# EAGLE design MacroKeypadProMicro (EAGLE 9.6.2)
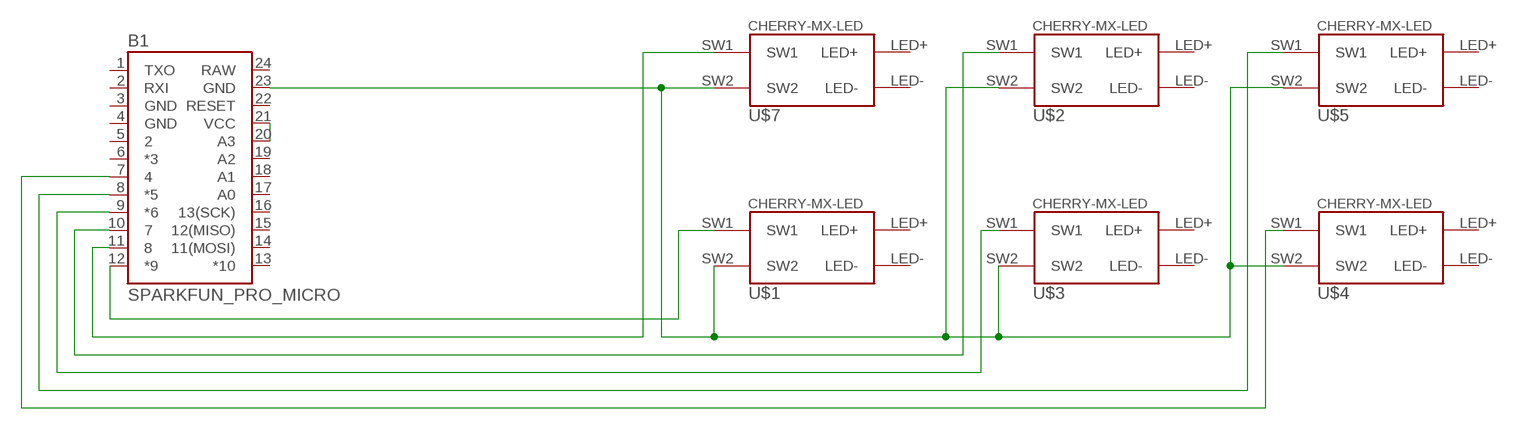
[diagram p0: schematic, sheet 1]

## Parts
B1  SPARKFUN_PRO_MICRO  [SPARKFUN_PRO_MICRO]
U$1  CHERRY-MX-LED  [CHERRY-MX-LED]
U$2  CHERRY-MX-LED  [CHERRY-MX-LED]
U$3  CHERRY-MX-LED  [CHERRY-MX-LED]
U$4  CHERRY-MX-LED  [CHERRY-MX-LED]
U$5  CHERRY-MX-LED  [CHERRY-MX-LED]
U$7  CHERRY-MX-LED  [CHERRY-MX-LED]

## Nets
GND: B1.23(GND) U$1.SW2 U$2.SW2 U$3.SW2 U$4.SW2 U$5.SW2 U$7.SW2
N$2: B1.20(A3) B1.21(VCC)
SW1: B1.11 U$7.SW1
SW2: B1.9(*6) U$3.SW1
SW3: B1.7 U$4.SW1
SW4: B1.12(*9) U$1.SW1
SW5: B1.10 U$2.SW1
SW6: B1.8(*5) U$5.SW1
Unconnected: B1.1(TXO) B1.2(RXI) B1.5 B1.6(*3) B1.13(*10) B1.14(11(MOSI)) B1.15(12(MISO)) B1.16(13(SCK)) B1.17(A0) B1.18(A1) B1.19(A2) B1.22(RESET) U$1.LED+ U$1.LED- U$2.LED+ U$2.LED- U$3.LED+ U$3.LED- U$4.LED+ U$4.LED- U$5.LED+ U$5.LED- U$7.LED+ U$7.LED-

## Power pins joined to a net without a drawn wire
GND: B1.3(GND) B1.4(GND)
RAW: B1.24(RAW)

## Library data of the parts
B1 = SparkFun-Boards:SPARKFUN_PRO_MICRO: SparkFun Pro Micro Atmega32U4 compatible footprint. SparkFun Products: 3.3V/8MHz <https://www.sparkfun.com/products/12587> 5V/16MHz <https://www.sparkfun.com/products/12640>
U$1-U$5 U$7 = cherrymx:CHERRY-MX-LED: Cherry MX series keyswitch with LED

## Board
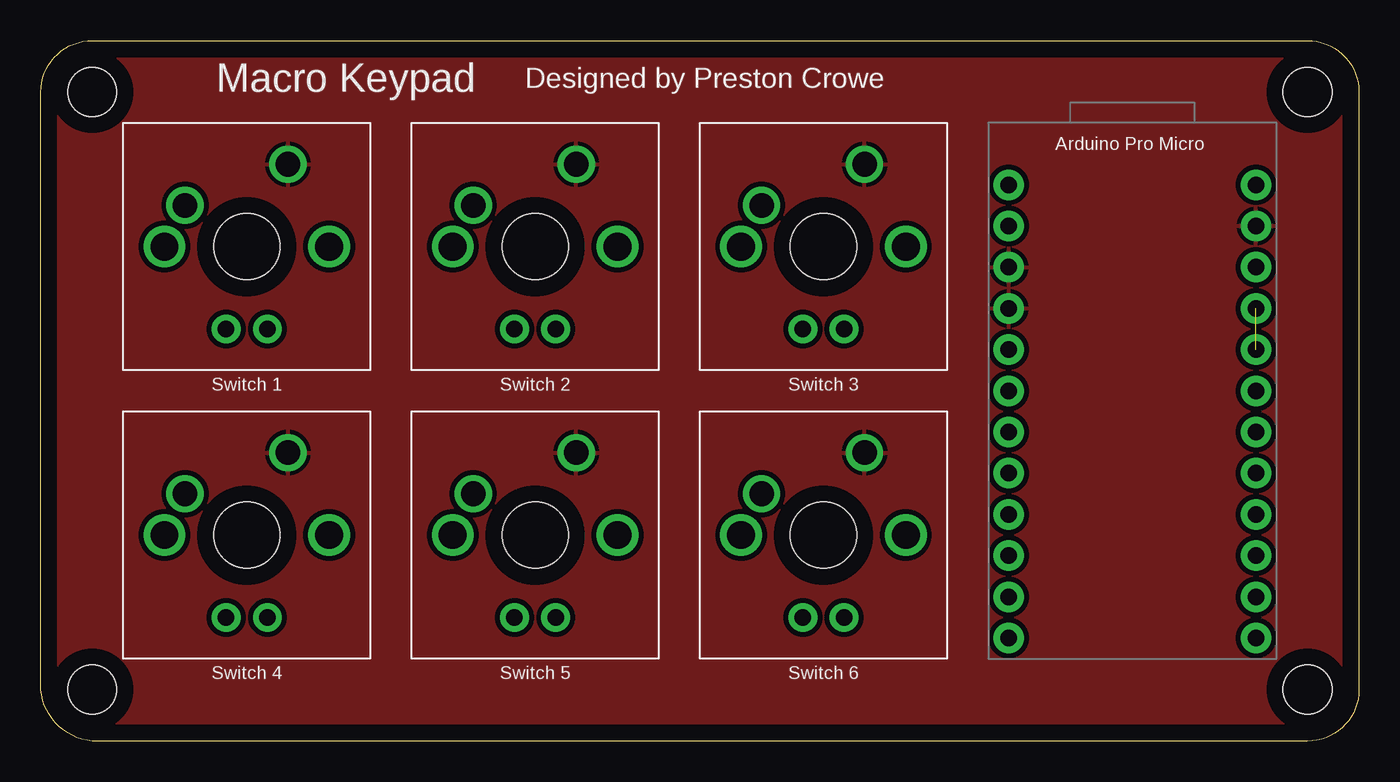
[diagram p1: board, top side]
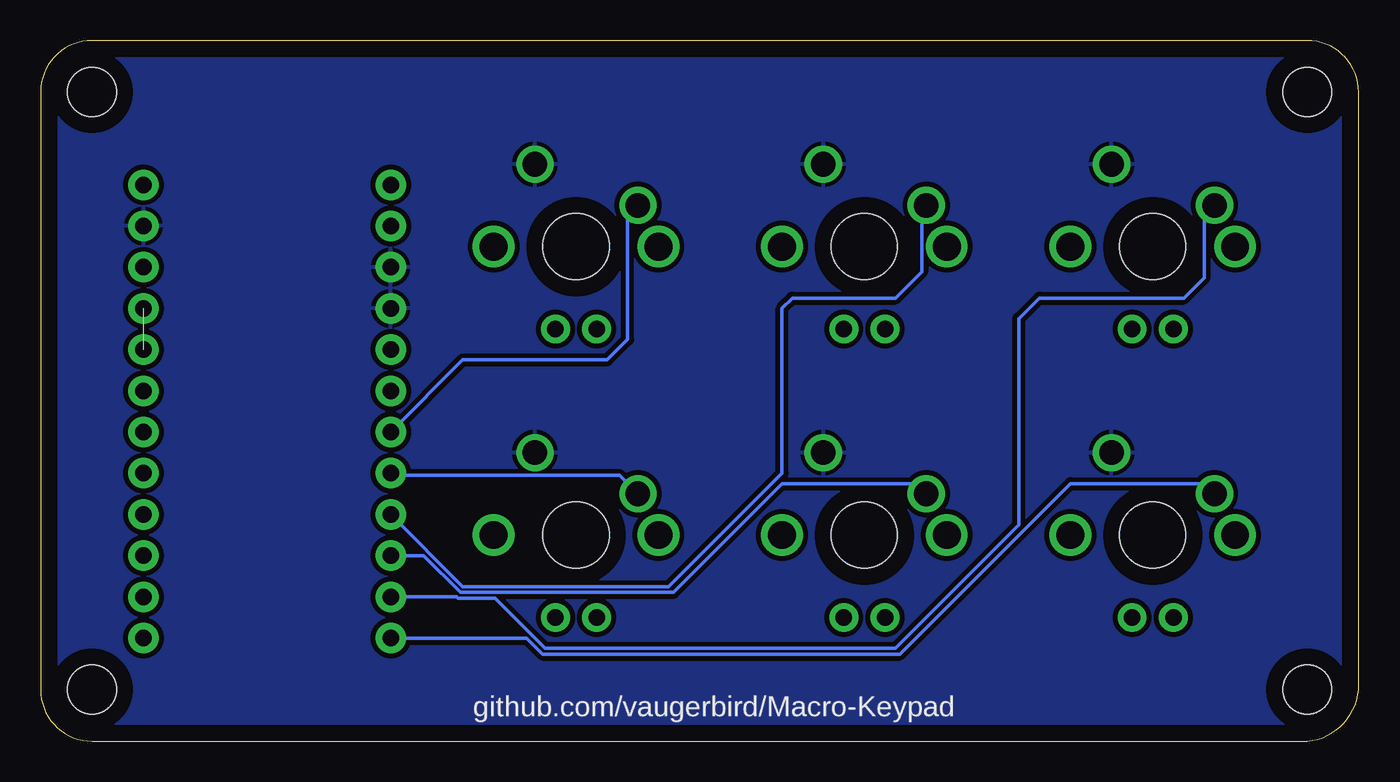
[diagram p2: board, bottom side, seen from below]

Size 81.29 x 43.18 mm. Coordinates in mm from the lower left corner, seen from the top.
Outline: 81.29,40.01 81.29,3.17 arc-90 78.12,0 3.19,0 arc-90 0.01,3.81 0.01,40.01 arc-90 3.19,43.18 78.12,43.18 arc-90 81.29,40.01
Copper layers (1*16): Top 0.035mm / dielectric 1.5mm / Bottom 0.035mm
Design rules "default": minimum track width 6mil, minimum drill 0.35mm, track to track 6mil, track to pad 6mil, pad to pad 6mil, via to via 6mil, smd to smd 6mil, copper to edge 40mil, drill to drill 6mil, minimum pad ring 10mil, minimum via ring 8mil, stop-mask expansion 4mil, vias tented up to drill 0mil, thermal gap 10mil
Holes 3 mm at 78.12,3.17 78.12,40.01 3.19,3.17 3.19,40.01

### Footprints (pad centres in the part's own frame; a part is rotated, then mirrored left to right if it is on the bottom)
SPARKFUN_PRO_MICRO = drill 1.016 pad 1.88: 1 -7.62,12.7; 2 -7.62,10.16; 3 -7.62,7.62; 4 -7.62,5.08; 5 -7.62,2.54; 6 -7.62,0; 7 -7.62,-2.54; 8 -7.62,-5.08; 9 -7.62,-7.62; 10 -7.62,-10.16; 11 -7.62,-12.7; 12 -7.62,-15.24; 13 7.62,-15.24; 14 7.62,-12.7; 15 7.62,-10.16; 16 7.62,-7.62; 17 7.62,-5.08; 18 7.62,-2.54; 19 7.62,0; 20 7.62,2.54; 21 7.62,5.08; 22 7.62,7.62; 23 7.62,10.16; 24 7.62,12.7
CHERRY-MX-LED = drill 1.016 pad 1.778: LED+ -1.27,-5.08; LED- 1.27,-5.08 | drill 1.714 pad 1.93: P$3 -5.08,0; P$4 5.08,0 | drill 1.524 pad 2.286: SW1 -3.81,2.54; SW2 2.54,5.08 | hole 4.064: 0,0

### Placement (x,y rotation side)
B1  67.32,21.59 0 top
U$1  12.71,12.7 0 top
U$2  30.49,12.7 0 top
U$3  30.49,30.48 0 top
U$4  48.27,30.48 0 top
U$5  48.27,12.7 0 top
U$7  12.71,30.48 0 top

### Tracks (layer width: path | path; a pad name or v marks a point on that pad's centre or on a via)
GND
  pour Top (isolate 0.305): 81.29,43.18 81.29,0 0.01,0 0.01,43.18
  pour Bottom (isolate 0.305): 81.29,43.18 81.29,0 0.01,0 0.01,43.18
N$2  (1 unrouted)
SW1
  Bottom 0.203: B1.11 55.63,8.89 55.55,8.81 53.28,8.81 50.18,5.71 28.59,5.71 20.97,13.34 20.97,26.04 19.7,27.3 10.81,27.3 9.54,28.57 9.54,32.38 U$7.SW1
SW2
  Bottom 0.203: B1.9 55.26,9.53 42.56,9.53 35.57,16.51 35.57,26.67 34.94,27.3 28.59,27.3 26.95,28.94 26.95,32.75 U$3.SW1
SW3
  Bottom 0.203: B1.7 55.26,23.5 46.37,23.5 45.1,24.77 45.1,32.38 U$4.SW1
SW4
  Bottom 0.203: B1.12 51.32,6.35 50.33,5.36 28.31,5.36 17.79,15.88 9.54,15.88 U$1.SW1
SW5
  Bottom 0.203: B1.10 57.67,11.43 55.41,9.17 42.28,9.17 35.57,15.88 27.32,15.88 U$2.SW1
SW6
  Bottom 0.203: B1.8 59.78,16.44 59.78,16.38 45.61,16.38 U$5.SW1

### Text on the board
tNames: Macro Keypad | Designed by Preston Crowe | Arduino Pro Micro | Switch 1 | Switch 2 | Switch 3 | Switch 4 | Switch 5 | Switch 6
bNames: github.com/vaugerbird/Macro-Keypad